# EAGLE schematic MainPSU (EAGLE 9.5.1)
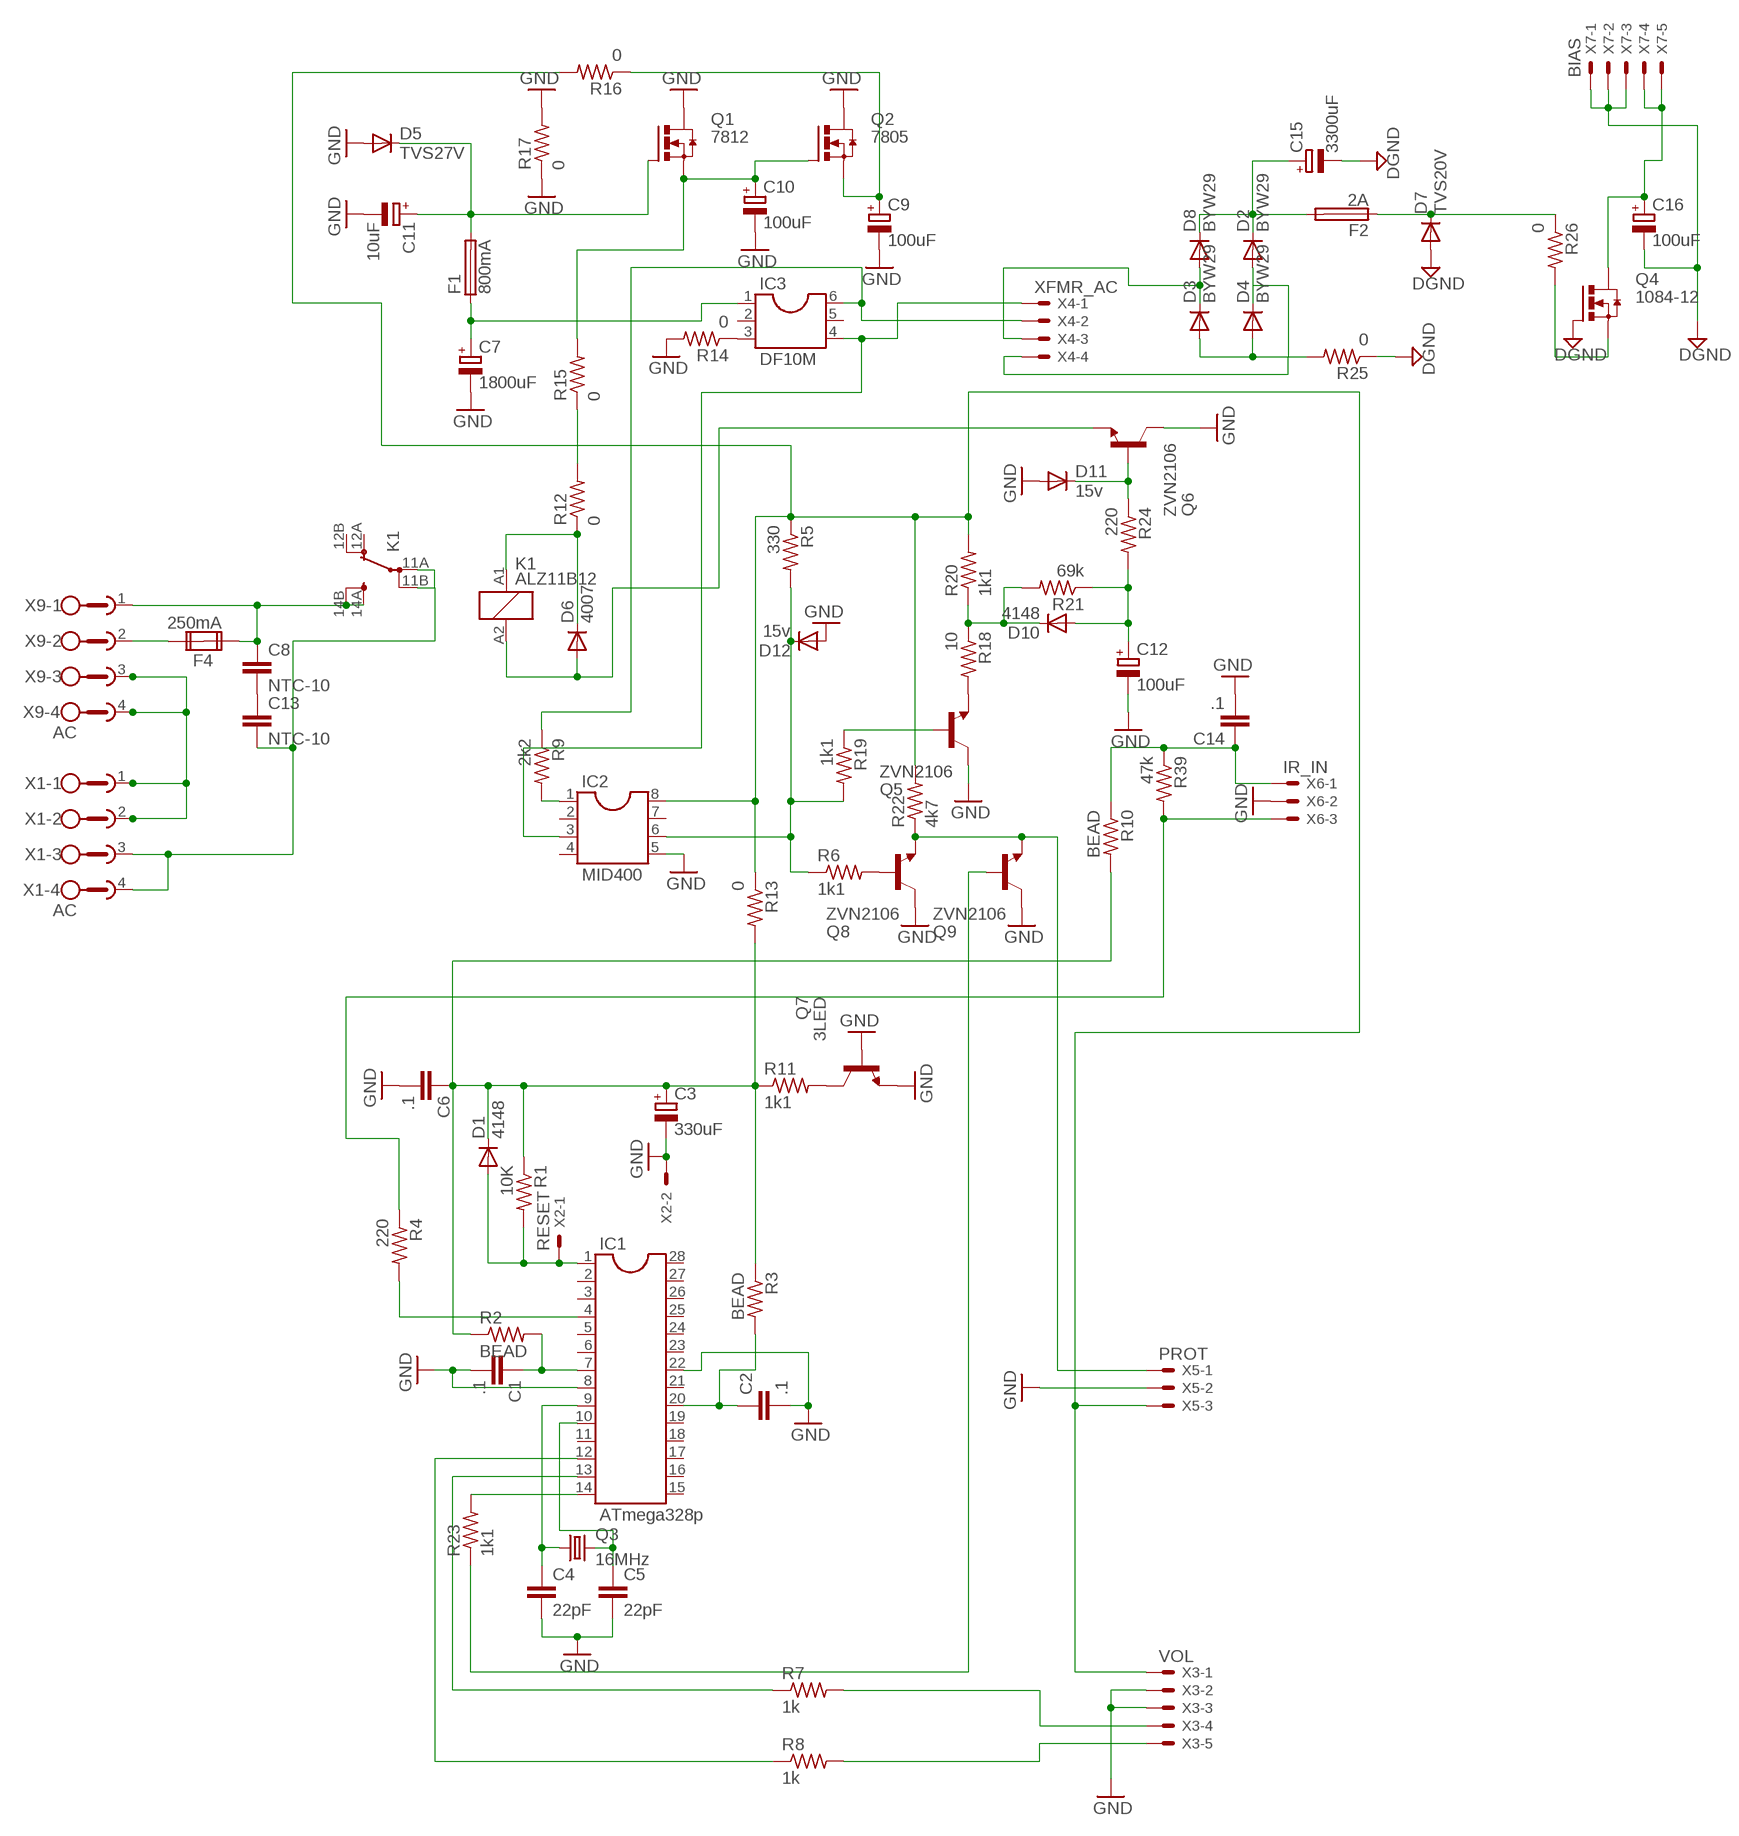
[diagram p0: schematic, sheet 1]

## Parts
C1  .1  C-EUC1210K  [C1210K]
C2  .1  C-EUC1210K  [C1210K]
C3  330uF  CPOL-EUE3.5-10  [E3,5-10]
C4  22pF  C-EUC1210K  [C1210K]
C5  22pF  C-EUC1210K  [C1210K]
C6  .1  C-EUC1210K  [C1210K]
C7  1800uF  CPOL-EUE7.5-16  [E7,5-16]
C8  NTC-10  C-EU102-054X133  [C102-054X133]
C9  100uF  CPOL-EUE3.5-10  [E3,5-10]
C10  100uF  CPOL-EUE3.5-10  [E3,5-10]
C11  10uF  CPOL-EUE3.5-10  [E3,5-10]
C12  100uF  CPOL-EUE3.5-10  [E3,5-10]
C13  NTC-10  C-EU102-054X133  [C102-054X133]
C14  .1  C-EUC1210K  [C1210K]
C15  3300uF  CPOL-EUE7.5-16  [E7,5-16]
C16  100uF  CPOL-EUE3.5-10  [E3,5-10]
D1  4148  1N4148DO35-7  [DO35-7]
D2  BYW29  [DO220S]
D3  BYW29  [DO220S]
D4  BYW29  [DO220S]
D5  TVS27V  BY448  [SOD57-10]
D6  4007  1N4004  [DO41-10]
D7  TVS20V  BY448  [SOD57-10]
D8  BYW29  [DO220S]
D10  4148  1N4148DO35-10  [DO35-10]
D11  15v  1N4148DO35-7  [DO35-7]
D12  15v  1N4148DO35-7  [DO35-7]
F1  800mA  19560  [19560]
F2  2A  19560  [19560]
F4  250mA  FUSE2P  [FUSE1]
IC1  ATmega328p  DIL28-3  [DIL28-3]
IC2  MID400  DIL8  [DIL08]
IC3  DF10M  DIL6  [DIL06]
K1  ALZ11B12  RT314730  [RT-C/O16A5]
Q1  7812  IRFI540NPBF  [TO220BH]
Q2  7805  IRFI540NPBF  [TO220BH]
Q3  16MHz  CRYSTALHC49S  [HC49/S]
Q4  1084-12  IRFI540NPBF  [TO220BH]
Q5  ZVN2106  BC550B  [TO92-EBC]
Q6  ZVN2106  BC550B  [TO92-EBC]
Q7  3LED  BC546A  [TO92-EBC]
Q8  ZVN2106  BC550B  [TO92-EBC]
Q9  ZVN2106  BC550B  [TO92-EBC]
R1  10K  R-US_0309/10  [0309/10]
R2  BEAD  R-US_0309/10  [0309/10]
R3  BEAD  R-US_0309/12  [0309/12]
R4  220  R-US_0309/12  [0309/12]
R5  330  R-US_0309/10  [0309/10]
R6  1k1  R-US_0309/12  [0309/12]
R7  1k  R-US_R1210  [R1210]
R8  1k  R-US_R1210  [R1210]
R9  2k2  R-US_0309/12  [0309/12]
R10  BEAD  R-US_0309/10  [0309/10]
R11  1k1  R-US_0309/10  [0309/10]
R12  0  R-US_0309/10  [0309/10]
R13  0  R-US_0309/12  [0309/12]
R14  0  R-US_0309/10  [0309/10]
R15  0  R-US_0309/12  [0309/12]
R16  0  R-US_0309/12  [0309/12]
R17  0  R-US_0309/12  [0309/12]
R18  10  R-US_0207/5V  [0207/5V]
R19  1k1  R-US_0309/12  [0309/12]
R20  1k1  R-US_0309/10  [0309/10]
R21  69k  R-US_0309/10  [0309/10]
R22  4k7  R-US_0309/10  [0309/10]
R23  1k1  R-US_R1210  [R1210]
R24  220  R-US_0309/10  [0309/10]
R25  0  R-US_0309/12  [0309/12]
R26  0  R-US_0309/12  [0309/12]
R39  47k  R-US_0309/10  [0309/10]
X1  AC  GMSTBA4  [GMSTBA4]
X2  RESET  22-23-2021  [22-23-2021]
X3  VOL  22-23-2051  [22-23-2051]
X4  XFMR_AC  5566-4  [5566-4]
X5  PROT  22-23-2031  [22-23-2031]
X6  IR_IN  22-23-2031  [22-23-2031]
X7  BIAS  22-23-2051  [22-23-2051]
X9  AC  GMSTBA4  [GMSTBA4]

## Nets
DGND: C15.- C16.- D7.A Q4.G R25.1 X7.1 X7.2 X7.3
GND: C1.2 C2.2 C3.- C4.2 C5.2 C6.2 C7.- C9.- C10.- C11.- C12.- C14.2 D5.A D11.A D12.A IC1.8 IC1.22 IC2.5 Q1.D Q2.D Q5.C Q6.C Q7.B Q7.E Q8.C Q9.C R14.2 R17.1 R17.2 X2.2 X3.2 X3.3 X5.2 X6.2
N$1: Q8.B R6.2
N$2: D1.A IC1.1 R1.2 X2.1
N$3: IC1.4 R4.2
N$4: C2.1 IC1.20 R3.2
N$5: R4.1 R39.2 X6.3
N$7: IC1.13 R7.1
N$8: IC1.12 R8.1
N$9: C11.+ D5.C F1.2 Q1.G
N$10: C8.2 C13.1
N$11: D6.C K1.A1 R12.1
N$12: IC3.6 R9.1 X4.2
N$13: C4.1 IC1.9 Q3.1
N$14: C5.1 IC1.10 Q3.2
N$15: X1.1 X1.2 X9.3 X9.4
N$16: D12.C IC2.6 R5.2 R6.1 R19.2
N$17: IC2.1 R9.2
N$18: Q8.E Q9.E R22.1 X5.1
N$19: IC3.3 R14.1
N$20: C14.1 R10.1 R39.1 X6.1
N$21: F4.2A X9.2
N$22: Q7.C R11.2
N$24: C8.1 F4.1A K1.14A(2:SA) K1.14B(2:SB) X9.1
N$25: C13.2 K1.11A(2:PA) K1.11B(2:PB) X1.3 X1.4
N$26: C9.+ Q2.S R16.1
N$28: C10.+ Q1.S Q2.G R15.2
N$29: R12.2 R15.1
N$30: C7.+ F1.1 IC3.1
N$32: C3.+ C6.1 D1.C R1.1 R2.1 R3.1 R10.2 R11.1 R13.2
N$33: D3.C D8.A X4.3
N$34: D2.A D4.C X4.4
N$35: C1.1 IC1.7 R2.2
N$36: IC2.8 R5.1 R13.1 R16.2 R20.2 R22.2 X3.1 X5.3
N$37: IC2.3 IC3.4 X4.1
N$38: Q5.B R19.1
N$39: D10.C R18.1 R20.1 R21.2
N$40: C12.+ D10.A R21.1 R24.2
N$41: IC1.14 R23.2
N$42: D6.A K1.A2 Q6.E
N$43: D11.C Q6.B R24.1
N$44: Q9.B R23.1
N$45: R8.2 X3.5
N$46: R7.2 X3.4
N$47: D3.A D4.A R25.2
N$48: C15.+ D2.C D8.C F2.2
N$49: D7.C F2.1 R26.1
N$52: Q4.S R26.2
N$53: Q5.E R18.2
N$56: C16.+ Q4.D X7.4 X7.5
Unconnected: F4.1B F4.2B IC1.2 IC1.3 IC1.5 IC1.6 IC1.11 IC1.15 IC1.16 IC1.17 IC1.18 IC1.19 IC1.21 IC1.23 IC1.24 IC1.25 IC1.26 IC1.27 IC1.28 IC2.2 IC2.4 IC2.7 IC3.2 IC3.5 K1.12A(2:OA) K1.12B(2:OB)

## Library data of the parts
C1 C2 C4-C6 C8 C13 C14 = resistor:C-EU: CAPACITOR, European symbol
C3 C7 C9-C12 C15 C16 = resistor:CPOL-EU: POLARIZED CAPACITOR, European symbol
D1 D10-D12 = diode:1N4148: DIODE high speed (Philips)
D2-D4 D8 = diode:BYW29: DIODE ultra fast rectifier, 200 V, 8 A
D5 D7 = diode:BY448: DIODE damper diode
D6 = diode:1N4004: DIODE general purpose rectifier, 1 A
F1 F2 = fuse:19560: FUSE HOLDER TR5, Wickmann; MPN: 56000001009; OC_FARNELL: 1185363; OC_NEWARK: 15P8392
F4 = special:FUSE2P: FUSE 5 x 20 mm
IC1 = ic-package:DIL28: Dual In Line
IC2 = ic-package:DIL8: Dual In Line / Socket
IC3 = ic-package:DIL6: Dual In Line / Socket
K1 = relay:RT31*: Power PCB Relayl SCHRACK 1 pole 12 / 16 A, DC- or AC-coi Source: http://www.schrack.com/.. 5819.pdf; MPN: RT314730; OC_FARNELL: 1629051; OC_NEWARK: 03P2424
Q1 Q2 Q4 = transistor-power:IRFI540NPBF: HEXFET Power MOISFET VDSS = 100V, RDS(on) = 0.052 Ohm, ID = 20A, VGS(th) = 2.0 -- 4.0V Source: http://www.irf.com/product-info/datasheets/data/irfi540npbf.pdf
Q3 = crystal:CRYSTAL: CRYSTAL; OC_FARNELL: 1667008; OC_NEWARK: unknown
Q5 Q6 Q8 Q9 = transistor-npn:BC550*: NPN Transistor
Q7 = transistor-npn:BC546*: NPN Transistor
R1-R26 R39 = resistor:R-US_: RESISTOR, American symbol
X1 X9 = con-phoenix-762:GMSTBA4: PHOENIX; MF: FARNELL; MPN: 1757268; OC_FARNELL: 3705195; OC_NEWARK: 71C4163
X2 = con-molex:22-23-2021: .100" (2.54mm) Center Header - 2 Pin; MF: MOLEX; MPN: 22-23-2021; OC_FARNELL: 1462926; OC_NEWARK: 25C3832
X3 X7 = con-molex:22-23-2051: .100" (2.54mm) Center Header - 5 Pin; MF: MOLEX; MPN: 22-23-2051; OC_FARNELL: 1462952; OC_NEWARK: 38C9178
X4 = con-molex:5566-4: Mini FIT connector 4 pol Source: http://www.molex.com; OC_FARNELL: unknown; OC_NEWARK: unknown
X5 X6 = con-molex:22-23-2031: .100" (2.54mm) Center Header - 3 Pin; MF: MOLEX; MPN: 22-23-2031; OC_FARNELL: 1462950; OC_NEWARK: 30C0862